# EAGLE design interro-io-board-r4 (EAGLE 5.12)
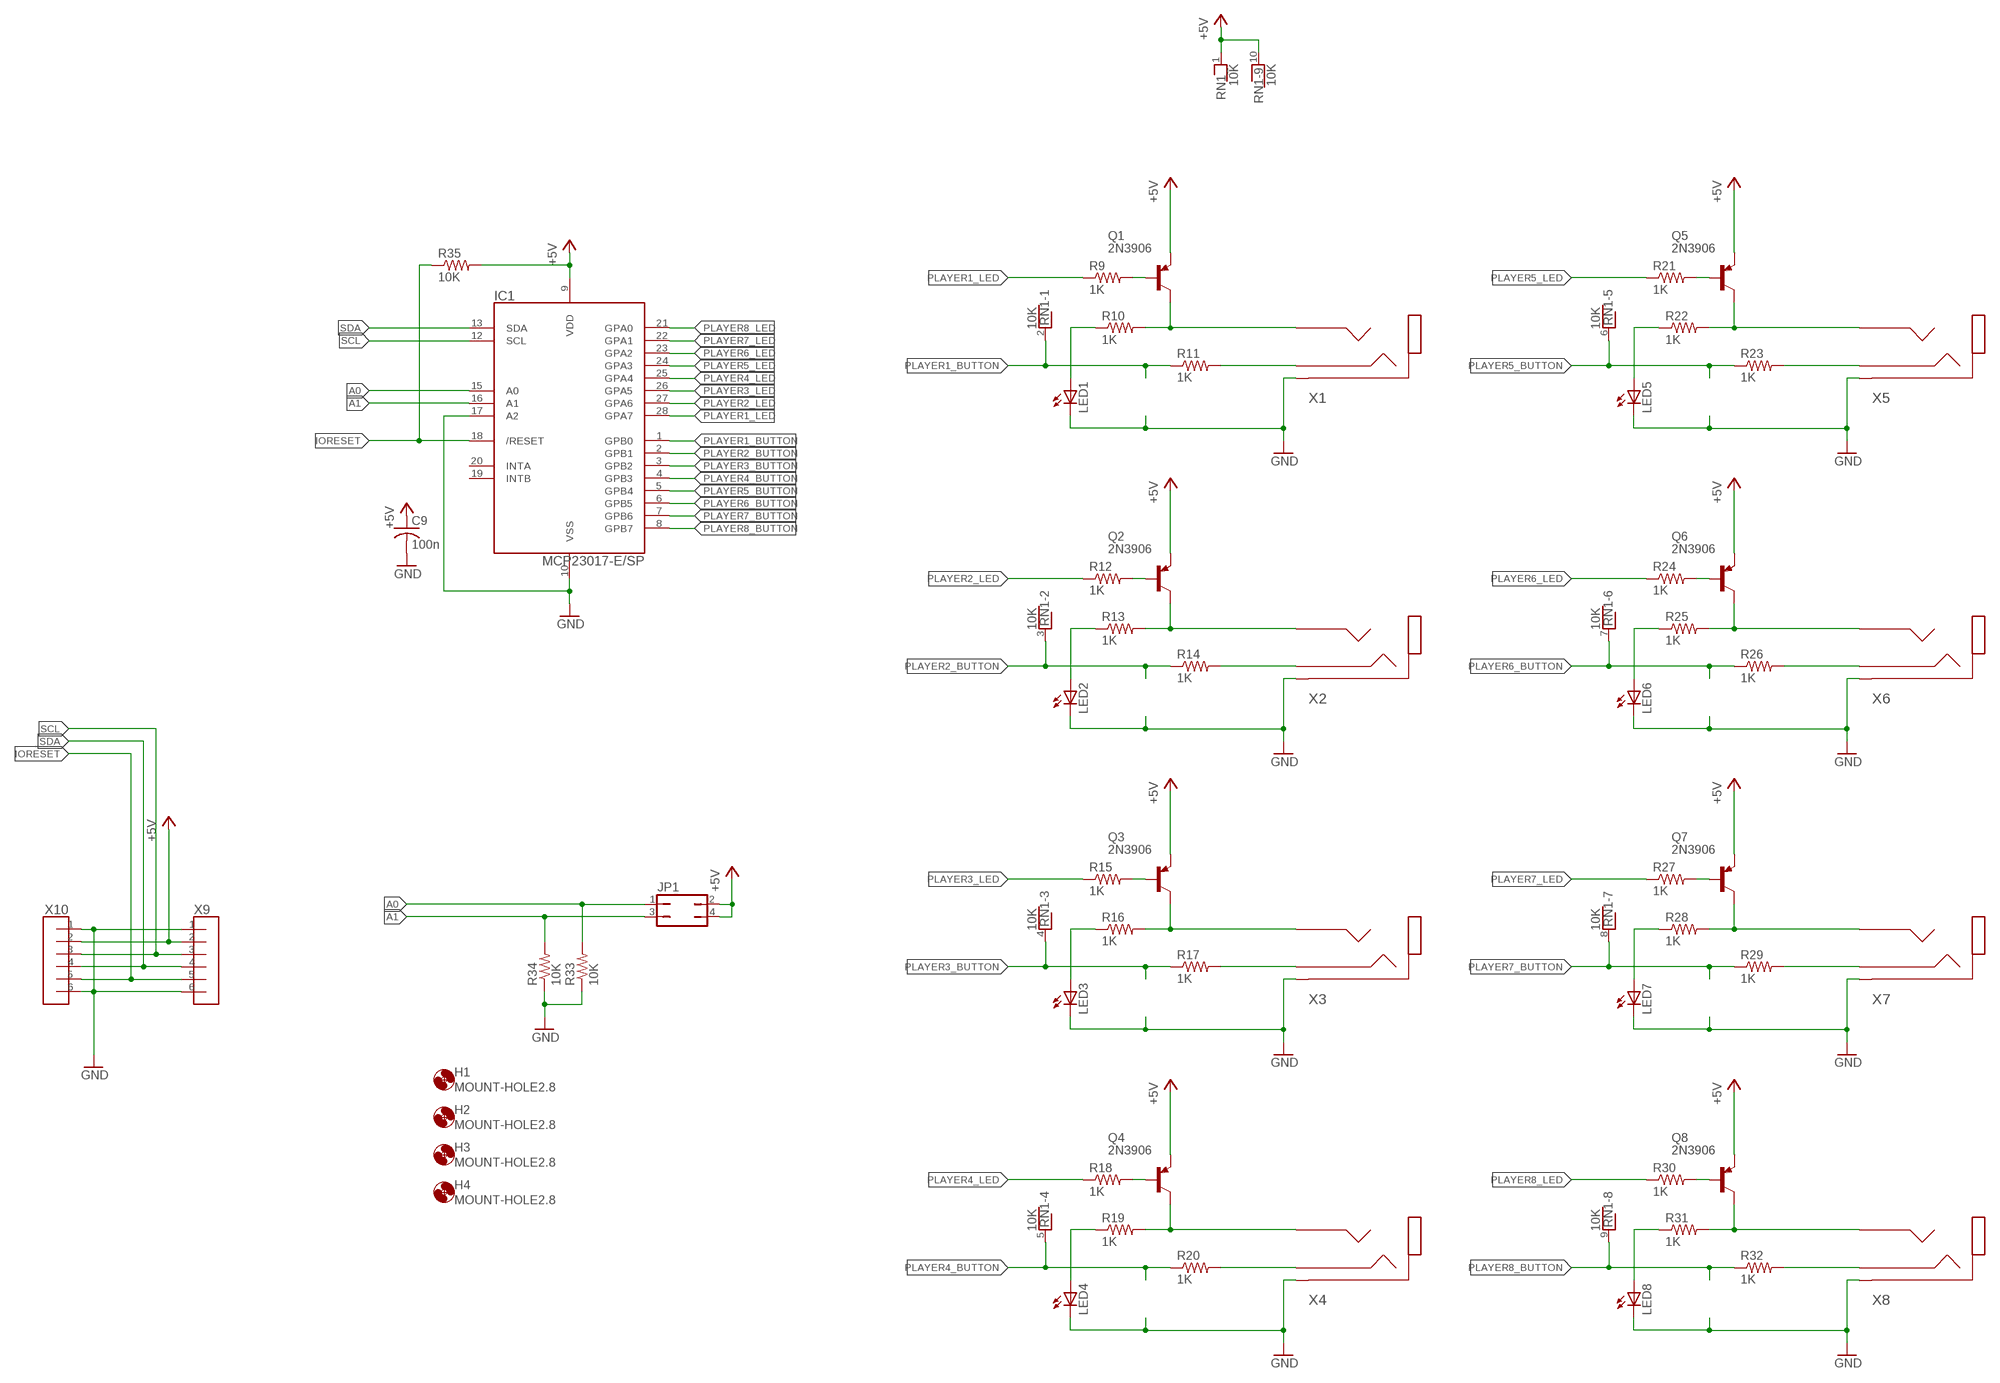
[diagram p0: schematic, sheet 1]

## Parts
C9  100n  C-US050-025X075  [C050-025X075]
H1  MOUNT-HOLE2.8  [2,8]
H2  MOUNT-HOLE2.8  [2,8]
H3  MOUNT-HOLE2.8  [2,8]
H4  MOUNT-HOLE2.8  [2,8]
IC1  MCP23017-E/SP  [DIP-28S]
JP1  JP2Q  [JP2Q]
LED1  LED3MM  [LED3MM]
LED2  LED3MM  [LED3MM]
LED3  LED3MM  [LED3MM]
LED4  LED3MM  [LED3MM]
LED5  LED3MM  [LED3MM]
LED6  LED3MM  [LED3MM]
LED7  LED3MM  [LED3MM]
LED8  LED3MM  [LED3MM]
Q1  2N3906  [TO92]
Q2  2N3906  [TO92]
Q3  2N3906  [TO92]
Q4  2N3906  [TO92]
Q5  2N3906  [TO92]
Q6  2N3906  [TO92]
Q7  2N3906  [TO92]
Q8  2N3906  [TO92]
R9  1K  R-US_0207/7  [0207/7]
R10  1K  R-US_0207/7  [0207/7]
R11  1K  R-US_0207/7  [0207/7]
R12  1K  R-US_0207/7  [0207/7]
R13  1K  R-US_0207/7  [0207/7]
R14  1K  R-US_0207/7  [0207/7]
R15  1K  R-US_0207/7  [0207/7]
R16  1K  R-US_0207/7  [0207/7]
R17  1K  R-US_0207/7  [0207/7]
R18  1K  R-US_0207/7  [0207/7]
R19  1K  R-US_0207/7  [0207/7]
R20  1K  R-US_0207/7  [0207/7]
R21  1K  R-US_0207/7  [0207/7]
R22  1K  R-US_0207/7  [0207/7]
R23  1K  R-US_0207/7  [0207/7]
R24  1K  R-US_0207/7  [0207/7]
R25  1K  R-US_0207/7  [0207/7]
R26  1K  R-US_0207/7  [0207/7]
R27  1K  R-US_0207/7  [0207/7]
R28  1K  R-US_0207/7  [0207/7]
R29  1K  R-US_0207/7  [0207/7]
R30  1K  R-US_0207/7  [0207/7]
R31  1K  R-US_0207/7  [0207/7]
R32  1K  R-US_0207/7  [0207/7]
R33  10K  R-US_0207/2V  [0207/2V]
R34  10K  R-US_0207/2V  [0207/2V]
R35  10K  R-US_0207/7  [0207/7]
RN1  10K  RNX9  [RN-10]
X1  SJ1-3533N  [SJ1-3533N]
X2  SJ1-3533N  [SJ1-3533N]
X3  SJ1-3533N  [SJ1-3533N]
X4  SJ1-3533N  [SJ1-3533N]
X5  SJ1-3533N  [SJ1-3533N]
X6  SJ1-3533N  [SJ1-3533N]
X7  SJ1-3533N  [SJ1-3533N]
X8  SJ1-3533N  [SJ1-3533N]
X9  M06-100MIL  [100MIL-6]
X10  M06-100MIL  [100MIL-6]

## Nets
+5V: C9.1 IC1.9(VDD) JP1.2 JP1.4 Q1.3(E) Q2.3(E) Q3.3(E) Q4.3(E) Q5.3(E) Q6.3(E) Q7.3(E) Q8.3(E) R35.2 RN1.1 RN1.10 X9.2 X10.2
A0: IC1.15(A0) JP1.1 R33.2
A1: IC1.16(A1) JP1.3 R34.2
GND: C9.2 IC1.10(VSS) IC1.17(A2) LED1.K(C) LED2.K(C) LED3.K(C) LED4.K(C) LED5.K(C) LED6.K(C) LED7.K(C) LED8.K(C) R33.1 R34.1 X1.SHIELD(SLEEVE) X2.SHIELD(SLEEVE) X3.SHIELD(SLEEVE) X4.SHIELD(SLEEVE) X5.SHIELD(SLEEVE) X6.SHIELD(SLEEVE) X7.SHIELD(SLEEVE) X8.SHIELD(SLEEVE) X9.1 X9.6 X10.1 X10.6
IORESET: IC1.18(/RESET) R35.1 X9.5 X10.5
N$9: R11.2 X1.RING
N$10: Q1.1(C) R10.2 X1.TIP
N$12: Q1.2(B) R9.2
N$13: LED1.A R10.1
N$14: R14.2 X2.RING
N$15: Q2.1(C) R13.2 X2.TIP
N$16: Q2.2(B) R12.2
N$17: LED2.A R13.1
N$18: R17.2 X3.RING
N$19: Q3.1(C) R16.2 X3.TIP
N$20: Q3.2(B) R15.2
N$21: LED3.A R16.1
N$22: R20.2 X4.RING
N$23: Q4.1(C) R19.2 X4.TIP
N$24: Q4.2(B) R18.2
N$25: LED4.A R19.1
N$26: R23.2 X5.RING
N$27: Q5.1(C) R22.2 X5.TIP
N$28: Q5.2(B) R21.2
N$29: LED5.A R22.1
N$30: R26.2 X6.RING
N$31: Q6.1(C) R25.2 X6.TIP
N$32: Q6.2(B) R24.2
N$33: LED6.A R25.1
N$34: R29.2 X7.RING
N$35: Q7.1(C) R28.2 X7.TIP
N$36: Q7.2(B) R27.2
N$37: LED7.A R28.1
N$38: R32.2 X8.RING
N$39: Q8.1(C) R31.2 X8.TIP
N$40: Q8.2(B) R30.2
N$41: LED8.A R31.1
PLAYER1_BUTTON: IC1.1(GPB0) R11.1 RN1.2
PLAYER1_LED: IC1.28(GPA7) R9.1
PLAYER2_BUTTON: IC1.2(GPB1) R14.1 RN1.3
PLAYER2_LED: IC1.27(GPA6) R12.1
PLAYER3_BUTTON: IC1.3(GPB2) R17.1 RN1.4
PLAYER3_LED: IC1.26(GPA5) R15.1
PLAYER4_BUTTON: IC1.4(GPB3) R20.1 RN1.5
PLAYER4_LED: IC1.25(GPA4) R18.1
PLAYER5_BUTTON: IC1.5(GPB4) R23.1 RN1.6
PLAYER5_LED: IC1.24(GPA3) R21.1
PLAYER6_BUTTON: IC1.6(GPB5) R26.1 RN1.7
PLAYER6_LED: IC1.23(GPA2) R24.1
PLAYER7_BUTTON: IC1.7(GPB6) R29.1 RN1.8
PLAYER7_LED: IC1.22(GPA1) R27.1
PLAYER8_BUTTON: IC1.8(GPB7) R32.1 RN1.9
PLAYER8_LED: IC1.21(GPA0) R30.1
SCL: IC1.12(SCL) X9.3 X10.3
SDA: IC1.13(SDA) X9.4 X10.4
Unconnected: IC1.19(INTB) IC1.20(INTA)

## Library data of the parts
C9 = rcl:C-US: CAPACITOR, American symbol
H1-H4 = holes:MOUNT-HOLE: MOUNTING HOLE with drill center marker
IC1 = rbg-microchip-ioexpander:MCP23017
JP1 = jumper:JP2Q: JUMPER
LED1-LED8 = led:LED: LED OSRAM: - CHIPLED LG R971, LG N971, LY N971, LG Q971, LY Q971, LO R971, LY R971 LH N974, LH R974 LS Q976, LO Q976, LY Q976 LO Q996 - Hyper CHIPLED LW Q18S LB Q993, LB Q99A, LB R99A - SideLED LS A670, LO A670, LY A670, LG A670, LP A670 LB A673, LV A673, LT A673, LW A673 LH A674 LY A675 LS A676, LA A676, LO A676, LY A676, LW A676 LS A679, LY A679, LG A679 - Hyper Micro SIDELED® LS Y876, LA Y876, LO Y876, LY Y876 LT Y87S - SmartLED LW L88C, LW L88S LB L89C, LB L89S, LG L890 LS L89K, LO L89K, LY L89K LS L896, LA L896, LO L896, LY L896 - TOPLED LS T670, LO T670, LY T670, LG T670, LP T670 LSG T670, LSP T670, LSY T670, LOP T670, LYG T670 LG T671, LOG T671, LSG T671 LB T673, LV T673, LT T673, LW T673 LH T674 LS T676, LA T676, LO T676, LY T676, LB T676, LH T676, LSB T676, LW T676 LB T67C, LV T67C, LT T67C, LS T67K, LO T67K, LY T67K, LW E67C LS E67B, LA E67B, LO E67B, LY E67B, LB E67C, LV E67C, LT E67C LW T67C LS T679, LY T679, LG T679 LS T770, LO T770, LY T770, LG T770, LP T770 LB T773, LV T773, LT T773, LW T773 LH T774 LS E675, LA E675, LY E675, LS T675 LS T776, LA T776, LO T776, LY T776, LB T776 LHGB T686 LT T68C, LB T68C - Hyper Mini TOPLED® LB M676 - Mini TOPLED Santana® LG M470 LS M47K, LO M47K, LY M47K Source: http://www.osram.convergy.de LUXEON: - LUMILED® LXK2-PW12-R00, LXK2-PW12-S00, LXK2-PW14-U00, LXK2-PW14-V00 LXK2-PM12-R00, LXK2-PM12-S00, LXK2-PM14-U00 LXK2-PE12-Q00, LXK2-PE12-R00, LXK2-PE12-S00, LXK2-PE14-T00, LXK2-PE14-U00 LXK2-PB12-K00, LXK2-PB12-L00, LXK2-PB12-M00, LXK2-PB14-N00, LXK2-PB14-P00, LXK2-PB14-Q00 LXK2-PR12-L00, LXK2-PR12-M00, LXK2-PR14-Q00, LXK2-PR14-R00 LXK2-PD12-Q00, LXK2-PD12-R00, LXK2-PD12-S00 LXK2-PH12-R00, LXK2-PH12-S00 LXK2-PL12-P00, LXK2-PL12-Q00, LXK2-PL12-R00 Source: www.luxeon.com KINGBRIGHT: KA-3528ASYC Source: www.kingbright.com
Q1-Q8 = transistor-pnp:2N3906: PNP Transistor
R9-R35 = rcl:R-US_: RESISTOR, American symbol
RN1 = resistor-net:RNX9: RESISTOR NETWORK; OC_FARNELL: unknown; OC_NEWARK: unknown
X1-X8 = rbg-cui-audio:SJ1-3533N
X9 X10 = rbg-generic-headers:M06-100MIL

## Board
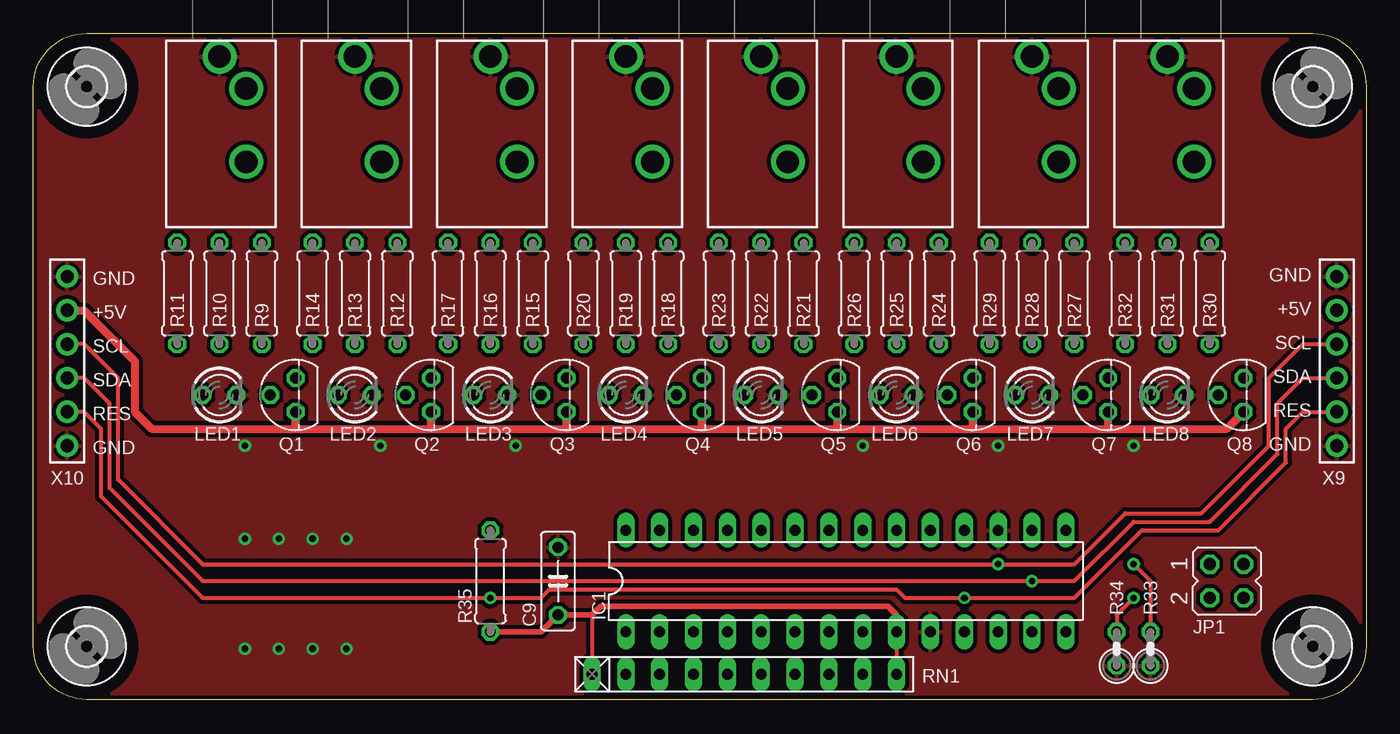
[diagram p1: board, top side]
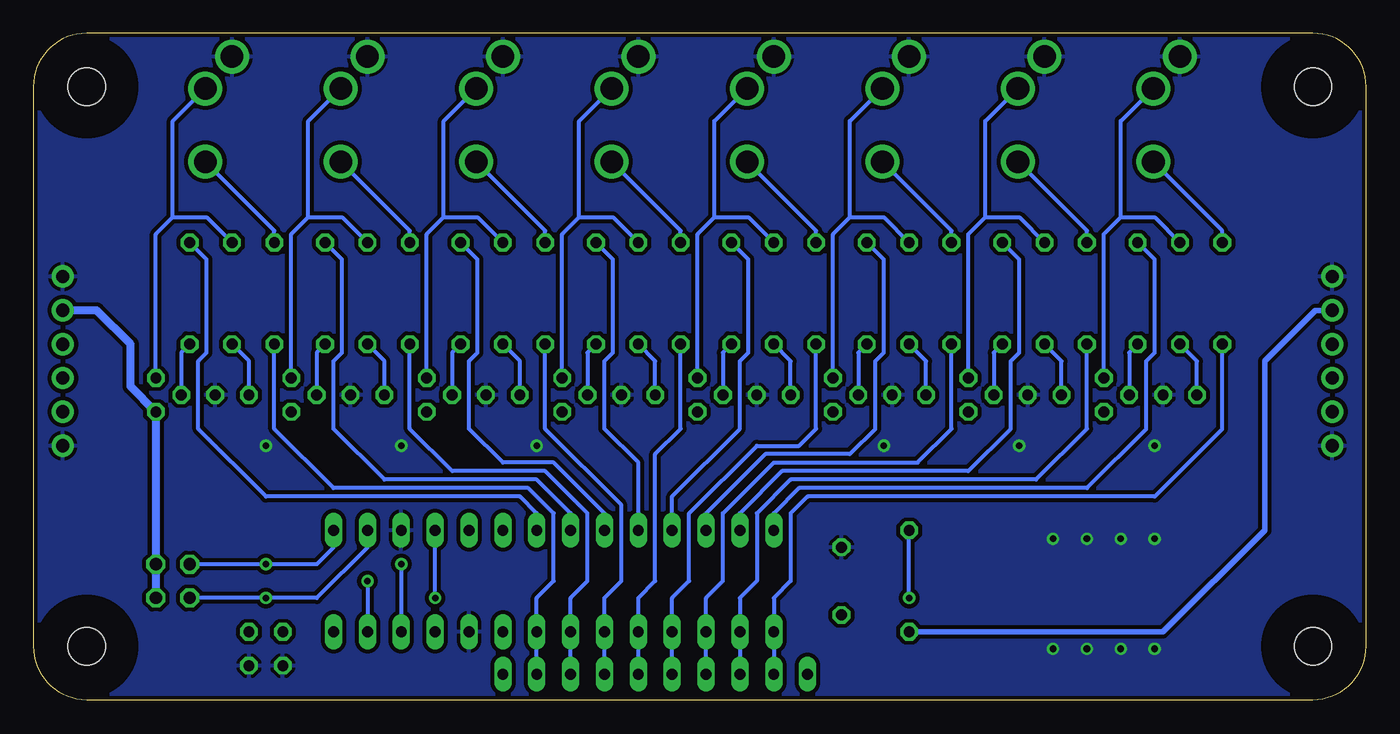
[diagram p2: board, bottom side, seen from below]

Size 100 x 50 mm. Coordinates in mm from the lower left corner, seen from the top.
Outline: 0,46 arc-90 4,50 96,50 arc-90 100,46 100,4 arc-90 96,0 4,0 arc-90 0,4 0,46
Copper layers (1*16): Top 0.035mm / dielectric 1.5mm / Bottom 0.035mm
Design rules "default *": minimum track width 10mil, minimum drill 19mil, track to track 10mil, track to pad 10mil, pad to pad 10mil, via to via 10mil, smd to smd 10mil, copper to edge 10mil, drill to drill 8mil, minimum pad ring 10mil, minimum via ring 8mil, stop-mask expansion 4mil, vias tented up to drill 20mil, thermal gap 10mil

### Footprints (pad centres in the part's own frame; a part is rotated, then mirrored left to right if it is on the bottom)
C050-025X075 = drill 0.813 octagon: 1 -2.54,0; 2 2.54,0
2,8 = hole 2.8: 0,0
DIP-28S = drill 0.813 long: 1 -16.51,-3.81; 2 -13.97,-3.81; 3 -11.43,-3.81; 4 -8.89,-3.81; 5 -6.35,-3.81; 6 -3.81,-3.81; 7 -1.27,-3.81; 8 1.27,-3.81; 9 3.81,-3.81; 10 6.35,-3.81; 11 8.89,-3.81; 12 11.43,-3.81; 13 13.97,-3.81; 14 16.51,-3.81; 15 16.51,3.81; 16 13.97,3.81; 17 11.43,3.81; 18 8.89,3.81; 19 6.35,3.81; 20 3.81,3.81; 21 1.27,3.81; 22 -1.27,3.81; 23 -3.81,3.81; 24 -6.35,3.81; 25 -8.89,3.81; 26 -11.43,3.81; 27 -13.97,3.81; 28 -16.51,3.81
JP2Q = drill 0.914 octagon: 1 -1.27,-1.27; 2 -1.27,1.27; 3 1.27,-1.27; 4 1.27,1.27
LED3MM = drill 0.813 octagon: A -1.27,0; K 1.27,0
TO92 = drill 0.813 octagon: 1 1.27,0; 2 0,1.905; 3 -1.27,0
0207/7 = drill 0.813 octagon: 1 -3.81,0; 2 3.81,0
0207/2V = drill 0.813 octagon: 1 -1.27,0; 2 1.27,0
RN-10 = drill 0.813 long: 1 -11.43,0; 2 -8.89,0; 3 -6.35,0; 4 -3.81,0; 5 -1.27,0; 6 1.27,0; 7 3.81,0; 8 6.35,0; 9 8.89,0; 10 11.43,0
SJ1-3533N = drill 1.7 round: RING 7.9,2; SHIELD 0,0; TIP 2.4,2
100MIL-6 = drill 1 pad 1.676 round: 1 -6.35,0; 2 -3.81,0; 3 -1.27,0; 4 1.27,0; 5 3.81,0; 6 6.35,0

### Placement (x,y rotation side)
C9  39.37,8.89 90 top
H1  4,4 0 top
H2  4,46 0 top
H3  96,46 0 top
H4  96,4 0 top
IC1  60.96,8.89 0 top
JP1  89.53,8.89 270 top
LED1  13.97,22.86 0 top
LED2  24.13,22.86 0 top
LED3  34.29,22.86 0 top
LED4  44.45,22.86 0 top
LED5  54.61,22.86 0 top
LED6  64.77,22.86 0 top
LED7  74.93,22.86 0 top
LED8  85.09,22.86 0 top
Q1  19.68,22.86 90 top
Q2  29.84,22.86 90 top
Q3  40.01,22.86 90 top
Q4  50.16,22.86 90 top
Q5  60.33,22.86 90 top
Q6  70.48,22.86 90 top
Q7  80.64,22.86 90 top
Q8  90.81,22.86 90 top
R9  17.14,30.48 270 top
R10  13.97,30.48 90 top
R11  10.79,30.48 90 top
R12  27.3,30.48 270 top
R13  24.13,30.48 90 top
R14  20.95,30.48 90 top
R15  37.47,30.48 270 top
R16  34.29,30.48 90 top
R17  31.11,30.48 90 top
R18  47.62,30.48 270 top
R19  44.45,30.48 90 top
R20  41.27,30.48 90 top
R21  57.78,30.48 270 top
R22  54.61,30.48 90 top
R23  51.44,30.48 90 top
R24  67.94,30.48 270 top
R25  64.77,30.48 90 top
R26  61.59,30.48 90 top
R27  78.11,30.48 270 top
R28  74.93,30.48 90 top
R29  71.75,30.48 90 top
R30  88.27,30.48 270 top
R31  85.09,30.48 90 top
R32  81.92,30.48 90 top
R33  83.82,3.81 90 top
R34  81.28,3.81 90 top
R35  34.29,8.89 270 top
RN1  53.34,1.91 0 top
X1  13.97,48.26 270 top
X2  24.13,48.26 270 top
X3  34.29,48.26 270 top
X4  44.45,48.26 270 top
X5  54.61,48.26 270 top
X6  64.77,48.26 270 top
X7  74.93,48.26 270 top
X8  85.09,48.26 270 top
X9  97.79,25.4 270 top
X10  2.54,25.4 270 top

### Tracks (layer width: path | path; a pad name or v marks a point on that pad's centre or on a via)
+5V
  Top 0.305: IC1.9 RN1.10 | 41.91,6.35 RN1.1
  Top 0.406: R35.2 38.1,5.08 C9.1 41.91,6.35 42.55,6.99 64.14,6.99 64.77,6.35 IC1.9
  Top 0.61: 19.68,20.32 29.84,20.32 | 29.84,20.32 40.01,20.32 | 40.01,20.32 50.16,20.32 | 50.16,20.32 60.33,20.32 | 60.33,20.32 70.48,20.32 | 70.48,20.32 80.64,20.32 | 19.68,20.32 Q1.3 | 29.84,20.32 Q2.3 | 40.01,20.32 Q3.3 | 80.64,20.32 Q7.3 | 70.48,20.32 Q6.3 | 60.33,20.32 Q5.3 | 50.16,20.32 Q4.3 | 80.64,20.32 89.53,20.32 Q8.3 | X10.2 3.81,29.21 7.62,25.4 7.62,21.59 8.89,20.32 19.68,20.32
  Bottom 0.406: R35.2 15.24,5.08 7.62,12.7 7.62,25.4 3.81,29.21 X10.2
  Bottom 0.61: JP1.4 JP1.2 Q8.3 92.71,23.5 92.71,26.67 95.25,29.21 X9.2
A0  (via drill 0.5)
  Top 0.305: v82.55,10.16 83.82,8.89 R33.2
  Bottom 0.305: JP1.1 v82.55,10.16 78.74,10.16 77.47,11.43 IC1.15
A1  (via drill 0.5)
  Top 0.305: v82.55,7.62 81.28,6.35 R34.2
  Bottom 0.305: JP1.3 v82.55,7.62 78.74,7.62 74.93,11.43 IC1.16
GND  (via drill 0.5)
  other vias: 36.2,19.05 26.04,19.05 15.88,19.05 82.55,19.05 72.39,19.05 62.23,19.05 15.88,12.06 20.95,12.06 23.5,12.06 23.5,3.81 20.95,3.81 18.41,3.81 15.88,3.81 18.41,12.06
  pour Bottom (isolate 0.305): -1.27,50.8 100.33,50.8 100.33,0 100.33,-1.27 -1.27,-1.27
  pour Top (isolate 0.305): -1.27,50.8 100.33,50.8 100.33,0 100.33,-1.27 -1.27,-1.27
IORESET  (via drill 0.5)
  Top 0.305: X9.5 95.25,21.59 93.98,20.32 93.98,17.78 88.9,12.7 83.19,12.7 78.11,7.62 v69.85,7.62 65.41,7.62 64.77,8.26 38.73,8.26 38.1,7.62 v34.29,7.62 12.7,7.62 5.08,15.24 5.08,20.32 3.81,21.59 X10.5
  Bottom 0.305: v34.29,7.62 R35.1 | v69.85,7.62 IC1.18
N$9
  Bottom 0.305: R11.2 10.79,35.19 X1.RING
N$10
  Bottom 0.305: Q1.1 19.68,34.92 18.41,36.2 | 18.41,36.2 18.41,43.41 X1.TIP | 18.41,36.2 15.88,36.2 R10.2
N$12
  Bottom 0.305: Q1.2 17.78,26.04 R9.2
N$13
  Bottom 0.305: LED1.A 12.7,25.4 R10.1
N$14
  Bottom 0.305: R14.2 20.95,35.19 X2.RING
N$15
  Bottom 0.305: Q2.1 29.84,34.92 28.57,36.2 | 28.57,36.2 28.57,43.41 X2.TIP | 28.57,36.2 26.04,36.2 R13.2
N$16
  Bottom 0.305: Q2.2 27.94,26.04 R12.2
N$17
  Bottom 0.305: LED2.A 22.86,25.4 R13.1
N$18
  Bottom 0.305: R17.2 31.11,35.19 X3.RING
N$19
  Bottom 0.305: Q3.1 40.01,34.92 38.73,36.2 | 38.73,36.2 38.73,43.41 X3.TIP | R16.2 36.2,36.2 38.73,36.2
N$20
  Bottom 0.305: Q3.2 38.1,26.04 R15.2
N$21
  Bottom 0.305: LED3.A 33.02,25.4 R16.1
N$22
  Bottom 0.305: R20.2 41.27,35.19 X4.RING
N$23
  Bottom 0.305: Q4.1 50.16,34.92 48.9,36.2 | 48.9,36.2 46.35,36.2 R19.2 | 48.9,36.2 48.9,43.41 X4.TIP
N$24
  Bottom 0.305: Q4.2 48.26,26.04 R18.2
N$25
  Bottom 0.305: LED4.A 43.18,25.4 R19.1
N$26
  Bottom 0.305: R23.2 51.44,35.19 X5.RING
N$27
  Bottom 0.305: Q5.1 60.33,34.92 59.05,36.2 | R22.2 56.52,36.2 59.05,36.2 | 59.05,36.2 59.05,43.41 X5.TIP
N$28
  Bottom 0.305: Q5.2 58.42,26.04 R21.2
N$29
  Bottom 0.305: LED5.A 53.34,25.4 R22.1
N$30
  Bottom 0.305: R26.2 61.59,35.19 X6.RING
N$31
  Bottom 0.305: Q6.1 70.48,34.92 69.22,36.2 | R25.2 66.67,36.2 69.22,36.2 | 69.22,36.2 69.22,43.41 X6.TIP
N$32
  Bottom 0.305: Q6.2 68.58,26.04 R24.2
N$33
  Bottom 0.305: LED6.A 63.5,25.4 R25.1
N$34
  Bottom 0.305: R29.2 71.75,35.19 X7.RING
N$35
  Bottom 0.305: X7.TIP 79.38,43.41 79.38,36.2 | Q7.1 80.64,34.92 79.38,36.2 | 79.38,36.2 76.83,36.2 R28.2
N$36
  Bottom 0.305: Q7.2 78.74,26.04 R27.2
N$37
  Bottom 0.305: LED7.A 73.66,25.4 R28.1
N$38
  Bottom 0.305: R32.2 81.92,35.19 X8.RING
N$39
  Bottom 0.305: X8.TIP 89.53,43.41 89.53,36.2 | Q8.1 90.81,34.92 89.53,36.2 | 89.53,36.2 87,36.2 R31.2
N$40
  Bottom 0.305: Q8.2 88.9,26.04 R30.2
N$41
  Bottom 0.305: R31.1 83.82,25.4 LED8.A
PLAYER1_BUTTON
  Bottom 0.305: R11.1 10.79,20.32 15.88,15.24 41.91,15.24 43.18,13.97 43.18,8.89 44.45,7.62 IC1.1 RN1.2
PLAYER1_LED
  Bottom 0.305: IC1.28 44.45,13.97 42.55,15.88 20.95,15.88 16.51,20.32 16.51,25.4 15.88,26.04 15.88,33.02 R9.1
PLAYER2_BUTTON
  Bottom 0.305: R14.1 20.95,20.32 24.77,16.51 43.18,16.51 45.72,13.97 45.72,8.89 46.99,7.62 IC1.2 RN1.3
PLAYER2_LED
  Bottom 0.305: IC1.27 46.99,13.97 43.81,17.14 29.84,17.14 26.67,20.32 26.67,25.4 26.04,26.04 26.04,33.02 R12.1
PLAYER3_BUTTON
  Bottom 0.305: R17.1 31.11,20.32 33.66,17.78 44.45,17.78 48.26,13.97 48.26,8.89 49.53,7.62 IC1.3 RN1.4
PLAYER3_LED
  Bottom 0.305: IC1.26 49.53,13.97 45.09,18.41 38.73,18.41 36.83,20.32 36.83,25.4 36.2,26.04 36.2,33.02 R15.1
PLAYER4_BUTTON
  Bottom 0.305: R20.1 41.27,20.32 42.55,19.05 45.72,19.05 50.8,13.97 50.8,8.89 52.07,7.62 IC1.4 RN1.5
PLAYER4_LED
  Bottom 0.305: IC1.25 52.07,15.24 46.99,20.32 46.99,25.4 46.35,26.04 46.35,33.02 R18.1
PLAYER5_BUTTON
  Bottom 0.305: R23.1 51.44,20.32 53.34,18.41 53.34,8.89 54.61,7.62 IC1.5 RN1.6
PLAYER5_LED
  Bottom 0.305: R21.1 56.52,33.02 56.52,26.04 57.15,25.4 57.15,20.32 54.61,17.78 IC1.24
PLAYER6_BUTTON
  Bottom 0.305: R26.1 61.59,20.32 55.88,14.61 55.88,8.89 57.15,7.62 IC1.6 RN1.7
PLAYER6_LED
  Bottom 0.305: IC1.23 57.15,13.97 60.96,17.78 64.77,17.78 67.31,20.32 67.31,25.4 66.67,26.04 66.67,33.02 R24.1
PLAYER7_BUTTON
  Bottom 0.305: R29.1 71.75,20.32 68.58,17.14 61.59,17.14 58.42,13.97 58.42,8.89 59.69,7.62 IC1.7 RN1.8
PLAYER7_LED
  Bottom 0.305: IC1.22 59.69,13.97 62.23,16.51 73.66,16.51 77.47,20.32 77.47,25.4 76.83,26.04 76.83,33.02 R27.1
PLAYER8_BUTTON
  Bottom 0.305: R32.1 81.92,20.32 77.47,15.88 62.87,15.88 60.96,13.97 60.96,8.89 62.23,7.62 IC1.8 RN1.9
PLAYER8_LED
  Bottom 0.305: IC1.21 62.23,13.97 63.5,15.24 82.55,15.24 87.63,20.32 87.63,25.4 87,26.04 87,33.02 R30.1
SCL  (via drill 0.5)
  Top 0.305: X9.3 95.25,26.67 92.71,24.13 92.71,19.05 87.63,13.97 81.92,13.97 78.11,10.16 v72.39,10.16 12.7,10.16 6.35,16.51 6.35,24.13 3.81,26.67 X10.3
  Bottom 0.305: v72.39,10.16 IC1.12
SDA  (via drill 0.5)
  Top 0.305: X9.4 95.25,24.13 93.34,22.23 93.34,18.41 88.27,13.34 82.55,13.34 78.11,8.89 v74.93,8.89 12.7,8.89 5.71,15.88 5.71,22.23 3.81,24.13 X10.4
  Bottom 0.305: v74.93,8.89 IC1.13

### Text on the board
tNames: GND | GND | +5V | +5V | SCL | SCL | SDA | SDA | RES | RES | GND | GND